# EAGLE schematic AD849x_Thermo (EAGLE 9.2.2)
COMPANY: ADAFRUIT INDUSTRIES; DRAWN: KTOWN; REV: A

## Sheet 1 of 2
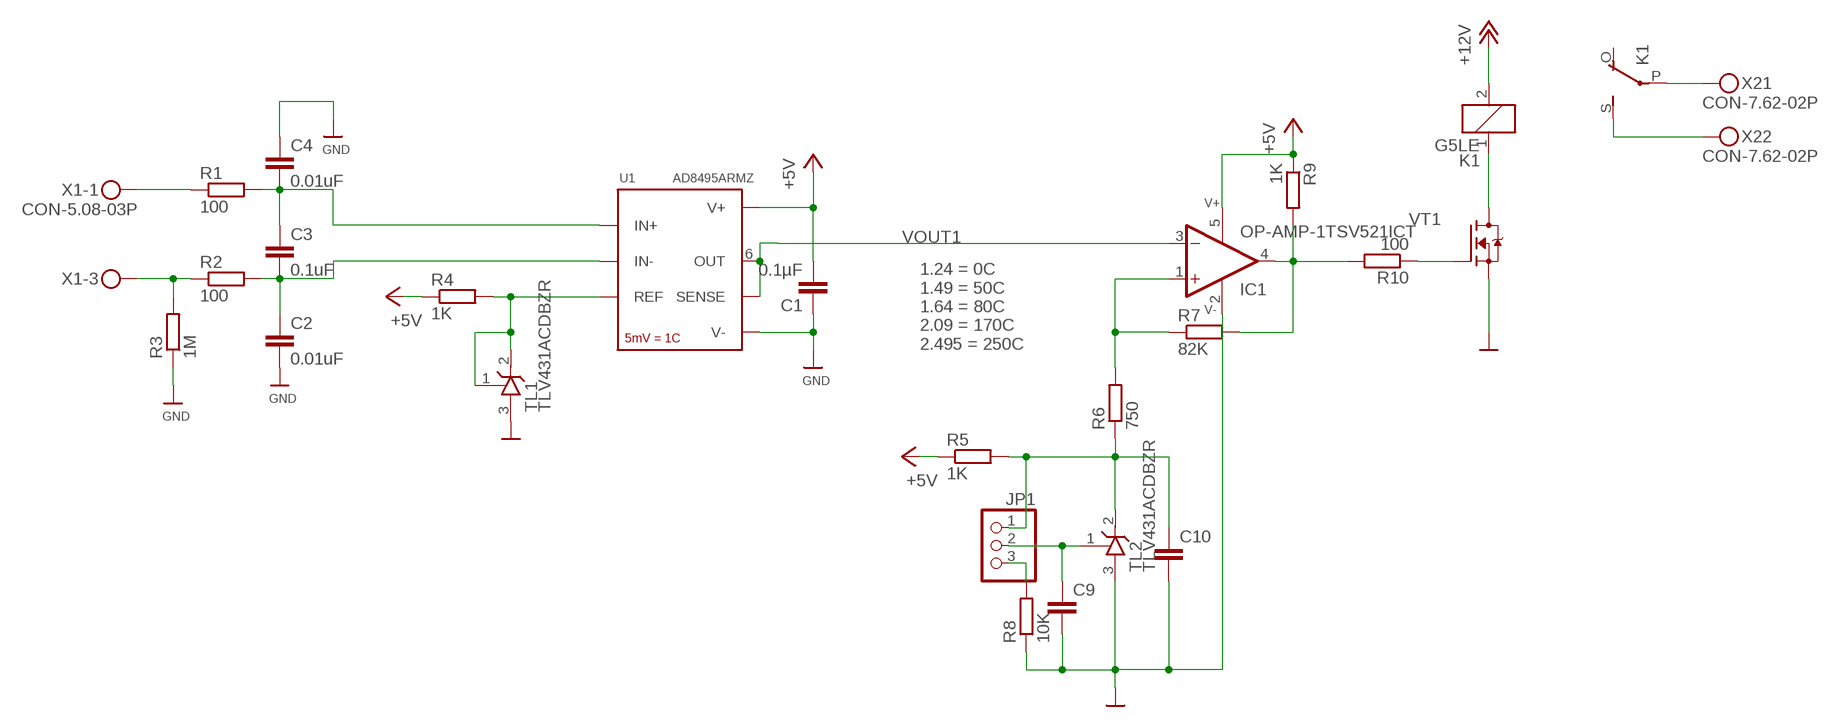
[diagram p0: schematic, sheet 1]

### Parts
C1  0.1µF  CAP_0805  [CAP0805]
C2  0.01uF  CAP_0805  [CAP0805]
C3  0.1uF  CAP_0805  [CAP0805]
C4  0.01uF  CAP_0805  [CAP0805]
C9  CAP_1206  [CAP1206]
C10  CAP_1206  [CAP1206]
IC1  OP-AMP-1TSV521ICT  [SC70-5L]
JP1  PINHD-1X3  [1X03]
K1  G5LE  [G5LE]
R1  100  R_R0805  [RESC2012X50]
R2  100  R_R0805  [RESC2012X50]
R3  1M  R_R0805  [RESC2012X50]
R4  1K  R_R0805  [RESC2012X50]
R5  1K  R_R0805  [RESC2012X50]
R6  750  R_R0805  [RESC2012X50]
R7  82K  R_R0805  [RESC2012X50]
R8  10K  R_R0805  [RESC2012X50]
R9  1K  R_R0805  [RESC2012X50]
R10  100  R_R0805  [RESC2012X50]
TL1  TLV431ACDBZR  IC-TLV431  [SOT95P240X115-3]
TL2  TLV431ACDBZR  IC-TLV431  [SOT95P240X115-3]
U1  AD8495ARMZ  [MSOP-8]
VT1  FET-NSOT-23  [SOT95P240X115-3]
X1  CON-5.08-03P  [MKDSN1,5/3-5,08]
X2  CON-7.62-02P  [KF25C-7.62-02P-13]

### Nets
+5V: C1.2 IC1.5(V+) R4.1 R5.1 R9.1 U1.7(V+) ; also sheet 2
+12V: K1.2 ; also sheet 2
GND: C1.1 C2.2 C4.1 C9.2 C10.2 IC1.2(V-) R3.1 R8.1 TL1.3(A) TL2.3(A) U1.3(V-) VT1.2(S) ; also sheet 2
IN+: R1.1 X1.1
IN-: R2.1 R3.2 X1.3
N$1: R4.2 TL1.1(R) TL1.2(C) U1.2(REF)
N$2: C3.1 C4.2 R1.2 U1.8(IN+)
N$3: C2.1 C3.2 R2.2 U1.1(IN-)
N$4: C10.1 JP1.1 R5.2 R6.1 TL2.2(C)
N$5: IC1.4(OUT) R7.2 R9.2 R10.2
N$6: IC1.1(+IN) R6.2 R7.1
N$7: JP1.3 R8.2
N$8: C9.1 JP1.2 TL2.1(R)
N$9: R10.1 VT1.1(G)
N$10: K1.1 VT1.3(D)
N$11: K1.P(2:P) X2.P$1
N$12: K1.S(2:S) X2.P$2
VOUT1: IC1.3(-IN) U1.5(SENSE) U1.6(OUT)
Unconnected: K1.O(2:O) X1.2

### Notes on the sheet
- 1.24 = 0C
  1.49 = 50C
  1.64 = 80C
  2.09 = 170C
  2.495 = 250C

## Sheet 2 of 2
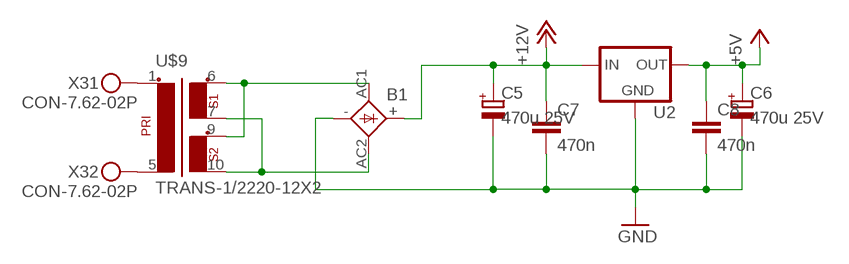
[diagram p1: schematic, sheet 2]

### Parts
B1  BRIDGEDBS  [DBS]
C5  470u 25V  CAP-POL_E2.5-7  [E2,5-7]
C6  470u 25V  CAP-POL_E2.5-7  [E2,5-7]
C7  470n  CAP_1206  [CAP1206]
C8  470n  CAP_1206  [CAP1206]
U2  V-REGDPAK  [DPAK]
U$9  TRANS-1/2220-12X2  [32.5-27.5-22]
X3  CON-7.62-02P  [KF25C-7.62-02P-13]

### Nets
+5V: C6.+ C8.1 U2.3(OUT) ; also sheet 1
+12V: B1.+ C5.+ C7.1 U2.1(IN) ; also sheet 1
GND: B1.- C5.- C6.- C7.2 C8.2 U2.2(PAD)(GND) ; also sheet 1
N$13: U$9.5(P1-2) X3.P$2
N$14: U$9.1(P1-1) X3.P$1
N$15: B1.AC1 U$9.6(S1-1) U$9.9(S2-1)
N$16: B1.AC2 U$9.7(S1-2) U$9.10(S2-2)

## Library data of the parts
B1 = Flamberm:BRIDGE: GENERAL INSTRUMENT RECTIFIER
C1-C4 C7-C10 = Flamberm:CAP_
C5 C6 = Flamberm:CAP-POL_
IC1 = Flamberm:OP-AMP-1
JP1 = pinhead:PINHD-1X3: PIN HEADER
K1 = relay:G5LE: RELAY 1 x switch, 10 A/120 V AC, 8 A/30 V DC, Omron; OC_FARNELL: unknown; OC_NEWARK: unknown
R1-R10 = Flamberm:R_
TL1 TL2 = Flamberm:IC-TLV431
U1 = Flamberm:AD8495
U2 = Flamberm:V-REG
U$9 = Flamberm:TRANS-1/2
VT1 = Flamberm:FET-N
X1 = Flamberm:CON-5.08-03P: MKDSN 1,5/ 3-5,08 Printklemme Nennstrom: 13,5 A Nennspannung: 250 V Rastermaß: 5,08 mm Polzahl: 3 Anschlussart: Schraubanschluss Montage: Löten Anschlussrichtung Leiter/Platine: 0 ° Artikelnummer: 1729131 Source: http://eshop.phoenixcontact.com .. 1729131.pdf
X2 X3 = Flamberm:CON-7.62-02P